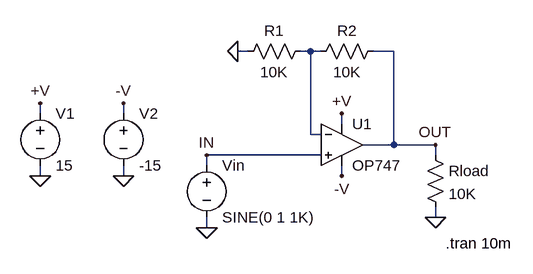
[diagram p0: schematic OP747.asc]
OP747.asc, the LTspice schematic file:
Version 4
SHEET 1 1240 700
WIRE 432 -1248 416 -1248
WIRE 528 -1248 512 -1248
WIRE 544 -1248 528 -1248
WIRE 656 -1248 624 -1248
WIRE 112 -1152 112 -1168
WIRE 240 -1152 240 -1168
WIRE 576 -1136 576 -1152
WIRE 528 -1120 528 -1248
WIRE 544 -1120 528 -1120
WIRE 656 -1104 656 -1248
WIRE 656 -1104 608 -1104
WIRE 720 -1104 656 -1104
WIRE 544 -1088 368 -1088
WIRE 720 -1088 720 -1104
WIRE 368 -1072 368 -1088
WIRE 112 -1056 112 -1072
WIRE 240 -1056 240 -1072
WIRE 576 -1056 576 -1072
WIRE 720 -992 720 -1008
WIRE 368 -976 368 -992
FLAG 112 -1168 +V
FLAG 112 -1056 0
FLAG 368 -976 0
FLAG 720 -1104 OUT
FLAG 368 -1088 IN
FLAG 576 -1152 +V
FLAG 240 -1168 -V
FLAG 576 -1056 -V
FLAG 416 -1248 0
FLAG 720 -992 0
FLAG 240 -1056 0
SYMBOL voltage 112 -1168 R0
WINDOW 123 0 0 Left 2
WINDOW 39 0 0 Left 2
SYMATTR InstName V1
SYMATTR Value 15
SYMBOL voltage 368 -1088 R0
WINDOW 123 24 146 Left 2
WINDOW 39 24 125 Left 2
SYMATTR InstName Vin
SYMATTR Value SINE(0 1 1K)
SYMBOL res 528 -1264 R90
WINDOW 0 0 56 VBottom 2
WINDOW 3 32 56 VTop 2
SYMATTR InstName R1
SYMATTR Value 10K
SYMBOL res 640 -1264 R90
WINDOW 0 0 56 VBottom 2
WINDOW 3 32 56 VTop 2
SYMATTR InstName R2
SYMATTR Value 10K
SYMBOL Opamps\\OP747 576 -1168 R0
SYMATTR InstName U1
SYMBOL voltage 240 -1168 R0
WINDOW 123 24 146 Left 2
WINDOW 39 24 125 Left 2
SYMATTR InstName V2
SYMATTR Value -15
SYMBOL res 704 -1104 R0
SYMATTR InstName Rload
SYMATTR Value 10K
TEXT 736 -952 Left 2 !.tran 10m

The netlist it stands for:
* OP747.asc
V1 +V 0 15
Vin IN 0 SINE(0 1 1K)
R1 N001 0 10K
R2 OUT N001 10K
XU1 IN N001 +V -V OUT OP747  ; pins In+ In- V+ V- OUT
V2 -V 0 -15
Rload OUT 0 10K
.tran 10m
.backanno
.end